# EasyEDA Pro project ProPrj_Embedded Tools_2024-11-02.epro, board X-Link&OSBDM
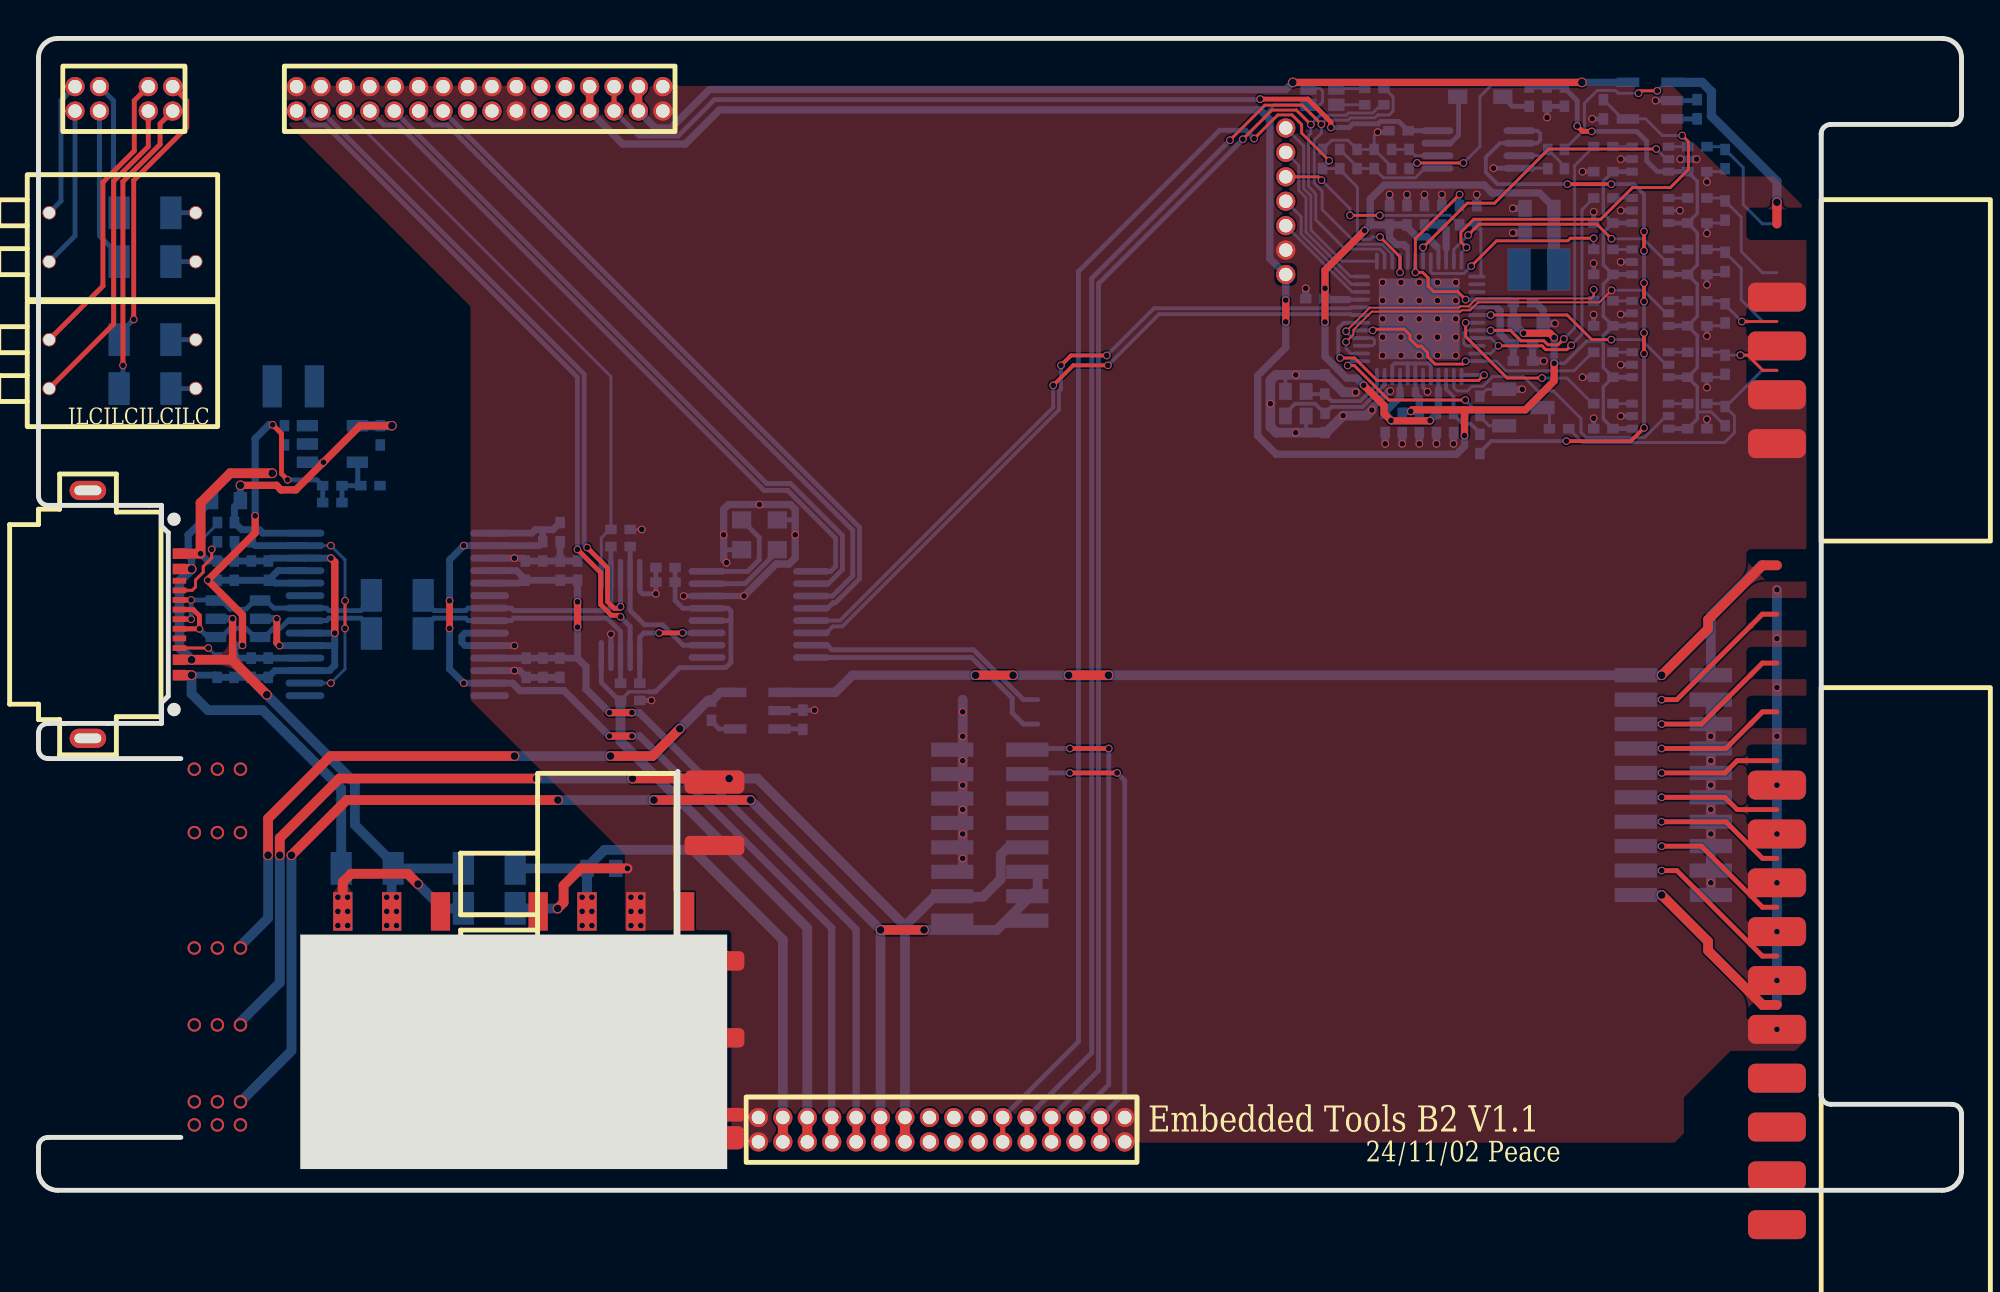
[diagram p9: board, top side]
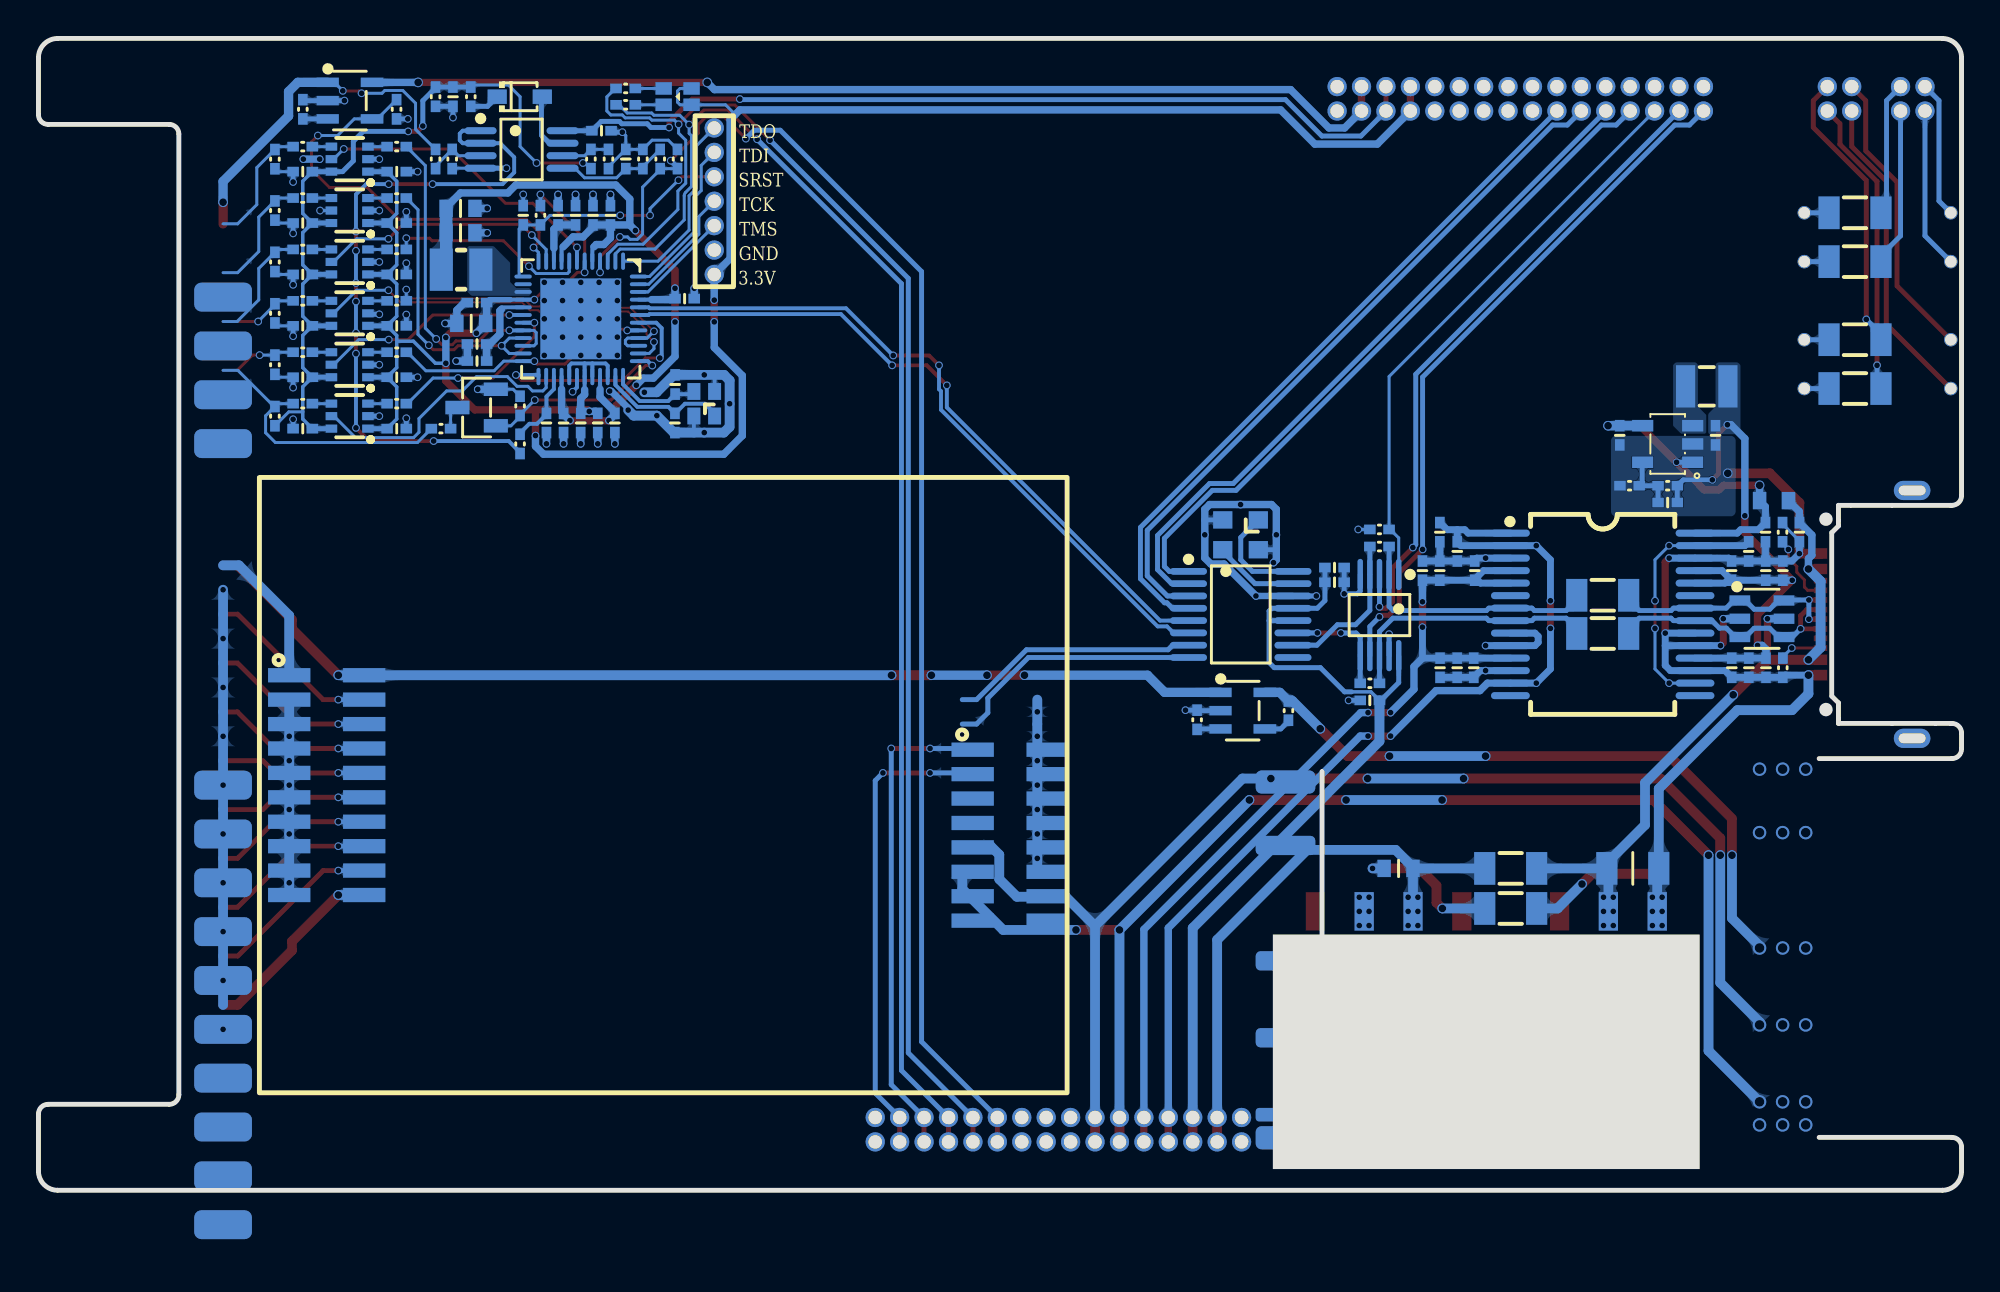
[diagram p10: board, bottom side, seen from below]

Outline 100 x 59.9 mm; copper layers: Top Layer, Bottom Layer. Coordinates in mm from the lower left corner of the outline.
Outline path: 7.4,22.45 0.5,22.45 arc(0.15,22.6) 0,22.95 0,23.78 arc(0.15,24.13) 0.5,24.28 0.57,24.28 ; 7.4,2.75 0.5,2.75 arc(0.15,2.6) 0,2.25 0,1 arc(0.29,0.29) 1,0 99,0 arc(99.71,0.29) 100,1 100,3.97 arc(99.85,4.32) 99.5,4.47 93.2,4.47 arc(92.85,4.62) 92.7,4.97 92.7,54.93 arc(92.85,55.28) 93.2,55.43 99.5,55.43 arc(99.85,55.58) 100,55.93 100,58.9 arc(99.71,59.61) 99,59.9 1,59.9 arc(0.29,59.61) 0,58.9 0,36.12 arc(0.15,35.77) 0.5,35.62 0.57,35.62
Stack: Top Layer 0.035mm / Dielectric1 1.51mm FR4 er 4.5 / Bottom Layer 0.035mm

## Design rules (mm)
template: 双面板
spacing copperThickness1oz (default): track to track 0.102, other pairs 0.102 to 0.201
spacing copperThickness2oz: track to track 0.203, other pairs 0.152 to 0.3
track width copperThickness1oz (default): min 0.102, default 0.254, max 2.54
track width copperThickness2oz: min 0.203, default 0.254, max 2.54
differential pair differentialPair (default): width min 0.127, default 0.254, max 2.54; gap min 0.152, default 0.152
via viaSize (default): diameter min 0.399, default 0.399, max 10; hole min 0.3, default 0.3, max 6.299

## Placement (name value [footprint] x y rotation side)
B1  600R@100MHz  [L0603]  9.75 35.86 0 bottom
C1  100nF  [C0402]  74.79 50.7 270 bottom
C2  100nF  [C0402]  69.46 53.63 270 bottom
C3  2.2uF  [C0402]  78.45 56.87 90 bottom
C4  10pF  [C0402]  66.9 39.9 90 bottom
C5  10pF  [C0402]  66.89 41.9 270 bottom
C6  100nF  [C0402]  70.72 55.1 180 bottom
C7  100nF  [C0402]  73.58 39.9 90 bottom
C8  22uF  [C0603]  77.5 45.08 180 bottom
C9  4.7uF  [C0402]  77.2 43.12 180 bottom
C10  4.7uF  [C0402]  72.07 50.7 270 bottom
C11  100nF  [C0402]  70.03 39.9 90 bottom
C12  4.7uF  [C0402]  70.92 39.9 90 bottom
C13  100nF  [C0402]  77.2 46.16 180 bottom
C14  100nF  [C0402]  77.2 44.01 180 bottom
C15  100nF  [C0402]  72.98 50.7 270 bottom
C16  22uF  [C0603]  78.05 51.06 0 bottom
C17  100nF  [C0402]  70.26 50.7 270 bottom
C18  100nF  [C0402]  71.81 39.9 90 bottom
C19  22uF  [C0603]  78.05 49.79 0 bottom
C20  100nF  [C0402]  72.69 39.9 90 bottom
C21  100nF  [C0402]  71.16 50.7 270 bottom
C22  100nF  [C0402]  66.4 46.37 0 bottom
C23  100nF  [C0402]  81.37 44.95 0 bottom
C24  100nF  [C0402]  81.37 42.28 0 bottom
C25  100nF  [C0402]  81.37 52.97 0 bottom
C26  100nF  [C0402]  81.37 50.3 0 bottom
C27  100nF  [C0402]  81.37 47.63 0 bottom
C28  100nF  [C0402]  81.37 39.61 0 bottom
C29  100nF  [C0402]  86.26 44.95 180 bottom
C30  100nF  [C0402]  86.26 42.28 180 bottom
C31  100nF  [C0402]  86.26 52.97 180 bottom
C32  100nF  [C0402]  86.26 50.3 180 bottom
C33  100nF  [C0402]  86.26 47.63 180 bottom
C34  100nF  [C0402]  86.26 39.61 180 bottom
C35  10uF  [C0402]  32.6 32.38 0 bottom
C36  100nF  [C0402]  32.6 31.62 0 bottom
C37  100nF  [C0402]  8.43 34.22 90 bottom
C38  4.7uF  [C0402]  17.77 39.26 90 bottom
C39  10pF  [C0402]  15.28 35.76 180 bottom
C40  10uF  [C0402]  12.79 39.26 90 bottom
C41  4.7uF  [C0402]  10.19 34.22 90 bottom
C42  100nF  [C0402]  11.07 33.22 90 bottom
C43  2.2uF  [C0402]  9.29 32.22 90 bottom
C44  2.2uF  [C0402]  10.17 27.17 270 bottom
C45  100uF  [C1206]  17.09 16.74 0 bottom
C46  100nF  [C0402]  10.18 32.22 90 bottom
C47  100nF  [C0402]  11.06 27.17 270 bottom
C48  10nF  [C0402]  11.96 32.22 90 bottom
C49  10nF  [C0402]  11.95 27.17 270 bottom
C50  2.2uF  [C0402]  28.03 32.22 90 bottom
C51  2.2uF  [C0402]  27.12 27.17 270 bottom
C52  22uF  [C0603]  29.27 16.74 180 bottom
C53  100nF  [C0402]  27.13 32.22 90 bottom
C54  100nF  [C0402]  26.23 27.17 270 bottom
C55  10nF  [C0402]  25.31 32.22 90 bottom
C56  10nF  [C0402]  25.36 27.17 270 bottom
C57  100nF  [C0402]  30.77 25.48 180 bottom
C58  4.7uF  [C0402]  27.13 34.22 90 bottom
C59  100nF  [C0402]  26.22 33.22 90 bottom
D1  -  [LED1615]  66.76 56.88 180 bottom
D2  1N5819WS  [SOD-323_L1.8-W1.3-LS2.5-RD]  74.97 56.87 180 bottom
D3  USBLC6-2SC6  [SOT-23-6_L2.9-W1.6-P0.95-LS2.8-BL]  10.38 29.72 270 bottom
L1  4.7uH  [IND-SMD_L2.5-W2.0]  78.02 47.88 180 bottom
L2  2.2uH  [IND-SMD_L2.5-W2.0_MHCHL2520]  13.25 41.81 180 bottom
NOREF  -  [Pad_e3233]  28.52 14.5 0 top
NOREF#2  -  [Pad_e3240]  31.06 14.5 0 top
NOREF#3  -  [Pad_e3157]  18.36 14.5 0 top
NOREF#4  -  [Pad_e3150]  15.82 14.5 0 top
P1  974dc19cbdb643b88376196303d419e6  [HDR-SMD_16P-P1.27-V-M-R2-C8-LS5.5]  50.01 21.07 270 bottom
P2  bb576532c6a742fab86a2945802cc5ea  [HDR-SMD_20P-P1.27-V-M-R2-C10-LS5.5]  85.01 21.07 270 bottom
P3  123946e5df864220b5dd1d9a534aecc2  [HDR-TH_7P-P1.27-V-M-1]  64.86 51.43 90 bottom
P4  120433638dee48a48d4bdcbcf660e3d8  [HDR-TH_10P-P1.27-V-M-R2-C5-S1.27_1]  4.44 56.76 0 top
P5  -  [IDC-SMD_8P-P2.54]  90.4 46.45 0 top
P6  -  [IDC-SMD_20P-P2.54]  90.4 21.07 0 top
Q1  SI2302A  [SOT-23-3_L2.9-W1.3-P1.90-LS2.4-BR]  77.22 40.71 180 bottom
R1  100K  [R0402]  35 24.94 90 bottom
R2  12K  [R0402]  39.75 24.47 270 bottom
R3  10K  [R0402]  73.9 50.7 90 bottom
R4  1K  [R0402]  66.77 53.63 90 bottom
R5  10K  [R0402]  67.67 53.63 90 bottom
R6  100K  [R0402]  68.57 53.63 90 bottom
R7  1K  [R0402]  69.47 57.3 180 bottom
R8  1K  [R0402]  69.47 56.45 180 bottom
R9  10K  [R0402]  71.27 53.63 90 bottom
R10  10K  [R0402]  70.36 53.63 270 bottom
R11  100R  [R0402]  77.52 56.87 270 bottom
R12  100K  [R0402]  79.35 56.87 270 bottom
R13  100K  [R0402]  79.35 53.63 270 bottom
R14  100K  [R0402]  78.49 53.63 270 bottom
R15  100K  [R0402]  81.38 56.22 90 bottom
R16  12K  [R0402]  86.25 56.22 270 bottom
R17  220R  [R0402]  81.37 46.25 0 bottom
R18  220R  [R0402]  81.37 43.58 0 bottom
R19  220R  [R0402]  81.37 54.27 0 bottom
R20  220R  [R0402]  81.37 51.6 0 bottom
R21  220R  [R0402]  81.37 48.93 0 bottom
R22  220R  [R0402]  81.37 40.91 0 bottom
R23  100K  [R0402]  74.96 40.79 90 bottom
R24  100K  [R0402]  87.7 40.26 90 bottom
R25  100R  [R0402]  79.07 39.61 0 bottom
R26  100R  [R0402]  86.26 46.25 0 bottom
R27  100R  [R0402]  86.26 43.58 0 bottom
R28  100R  [R0402]  86.26 54.27 0 bottom
R29  100R  [R0402]  86.26 51.6 0 bottom
R30  100R  [R0402]  86.26 48.93 0 bottom
R31  100R  [R0402]  86.26 40.91 0 bottom
R32  200K  [R0402]  87.7 45.6 90 bottom
R33  200K  [R0402]  87.7 42.93 90 bottom
R34  200K  [R0402]  87.7 53.62 90 bottom
R35  200K  [R0402]  87.7 50.95 90 bottom
R36  200K  [R0402]  87.7 48.28 90 bottom
R37  5.1K  [R0402]  9.29 27.17 90 bottom
R38  5.1K  [R0402]  9.31 34.22 270 bottom
R39  200K  [R0402]  15.28 36.64 180 bottom
R40  100K  [R0402]  17.26 36.64 180 bottom
R41  100K  [R0402]  30.27 34.37 0 bottom
R42  0R/NC  [R1206]  23.44 16.74 0 bottom
R43  0R/NC  [R1206]  23.44 14.66 0 bottom
R44  0R/NC  [R1206]  18.66 30.94 0 bottom
R45  0R/NC  [R1206]  18.66 28.96 0 bottom
R46  0R/NC  [R0402]  30.27 33.48 0 bottom
R47  0R/NC  [R0402]  30.77 26.37 0 bottom
R48  120R  [R1206]  5.54 50.83 0 bottom
R49  120R  [R1206]  5.54 48.29 0 bottom
R50  120R  [R1206]  5.54 44.23 0 bottom
R51  120R  [R1206]  5.54 41.69 0 bottom
R52  1K  [R0402]  74.96 38.81 90 bottom
SW1  SS23H37L4  [SW-TH_SS23H37LX_SMD]  9.3 12.6 0 top
U1  SY6280AAC  [SOT-23-5_L3.0-W1.7-P0.95-LS2.8-BL]  37.38 24.94 270 bottom
U2  0fddbf5b7085485a9a03ce0ba17bfba0  [QFN-48_L6.0-W6.0-P0.4-BL-EP4.2]  71.8 45.32 0 bottom
U3  SY6280AAC  [SOT-23-5_L3.0-W1.7-P0.95-LS2.8-BL]  83.81 56.67 270 bottom
U4  74LVC1T45DW-7  [SC-70-6_L2.2-W1.3-P0.65-LS2.1-BR]  83.82 45.6 180 bottom
U5  74LVC1T45DW-7  [SC-70-6_L2.2-W1.3-P0.65-LS2.1-BR]  83.82 42.93 180 bottom
U6  74LVC1T45DW-7  [SC-70-6_L2.2-W1.3-P0.65-LS2.1-BR]  83.82 53.62 180 bottom
U7  74LVC1T45DW-7  [SC-70-6_L2.2-W1.3-P0.65-LS2.1-BR]  83.82 50.95 180 bottom
U8  74LVC1T45DW-7  [SC-70-6_L2.2-W1.3-P0.65-LS2.1-BR]  83.82 48.28 180 bottom
U9  74LVC1T45DW-7  [SC-70-6_L2.2-W1.3-P0.65-LS2.1-BR]  83.82 40.26 180 bottom
U10  CH334R  [QSOP-16_L4.9-W3.9-P0.64-LS6.0-BL]  37.48 29.95 270 bottom
U11  TLV62568DBVR  [SOT-23-5_L3.0-W1.7-P0.95-LS2.8-BR]  15.28 38.81 180 bottom
U12  ISOUSB211DPR  [SSOP-28_L10.3-W7.5-P0.65-LS10.3-BL]  18.66 29.95 270 bottom
U13  VRB0505S-5WR3  [PWRM-TH_7P-L22.0-W9.5-P2.54_VRB0505S-5WR3_ST]  24.71 14.5 0 top
U14  SGM7222YMS10/TR  [MSOP-10_L3.0-W3.0-P0.50-LS5.0-BL]  30.27 29.91 0 bottom
U15  d41f87750cb249d39c6e00b53de6cf37  [HDR-TH_32P-P1.27-V-M-R2-C16-S1.27]  46.96 3.15 0 top
U16  d41f87750cb249d39c6e00b53de6cf37  [HDR-TH_32P-P1.27-V-M-R2-C16-S1.27]  22.95 56.76 0 top
U17  SMQP-02R-TP  [SW-TH_4P-P2.54_SMQP-02R-TP]  4.37 49.56 270 top
U18  SMQP-02R-TP  [SW-TH_4P-P2.54_SMQP-02R-TP]  4.37 42.96 270 top
U19  LMV358AIDGKR  [VSSOP-8_L3.0-W3.0-P0.65-LS5.0-BL]  74.88 54.13 270 bottom
USB1  USB31-TYPEC-16X7C-1FS  [USB-SMD_USB31-TYPEC-16X7C-1FS]  4.95 29.95 270 top
X1  24MHz  [CRYSTAL-SMD_4P-L2.0-W1.6-BL-A]  65.38 40.9 90 bottom
X2  12MHz  [CRYSTAL-SMD_4P-L2.5-W2.0-BL-A]  37.49 34.09 0 bottom

## Footprints (pads in the part's own frame, mm; a bottom-side part is the same pattern mirrored in y, then rotated)
C0402
  rect 0.6x0.5 smd: 1(-0.5,0) 2(0.5,0)
C0603
  rect 0.7x0.9 smd: 1(-0.75,0) 2(0.75,0)
C1206
  rect 1.1x1.7 smd: 1(-1.35,0) 2(1.35,0)
CRYSTAL-SMD_4P-L2.0-W1.6-BL-A
  rect 0.875x0.673 smd: 1(-0.638,-0.539) 2(0.638,-0.539) 3(0.638,0.539) 4(-0.638,0.539)
CRYSTAL-SMD_4P-L2.5-W2.0-BL-A
  rect 1x0.9 smd: 1(-0.925,-0.775) 2(0.925,-0.775) 3(0.925,0.775) 4(-0.925,0.775)
HDR-SMD_16P-P1.27-V-M-R2-C8-LS5.5
  rect 0.74x2.2 smd: 1(-1.841,-1.409) 2(-1.841,2.49) 3(-0.572,-1.409) 4(-0.572,2.49) 5(0.699,-1.409) 6(0.699,2.49) 7(1.968,-1.409) 8(1.968,2.49) 9(3.239,-1.409) 10(3.239,2.49) 11(4.508,-1.409) 12(4.508,2.49) 13(5.779,-1.409) 14(5.779,2.49) 15(7.048,-1.409) 16(7.048,2.49)
HDR-SMD_20P-P1.27-V-M-R2-C10-LS5.5
  rect 0.74x2.2 smd: 1(-5.715,-1.95) 2(-5.715,1.95) 3(-4.445,-1.95) 4(-4.445,1.95) 5(-3.175,-1.95) 6(-3.175,1.95) 7(-1.905,-1.95) 8(-1.905,1.95) 9(-0.635,-1.95) 10(-0.635,1.95) 11(0.635,-1.95) 12(0.635,1.95) 13(1.905,-1.95) 14(1.905,1.95) 15(3.175,-1.95) 16(3.175,1.95) 17(4.445,-1.95) 18(4.445,1.95) 19(5.715,-1.95) 20(5.715,1.95)
HDR-TH_7P-P1.27-V-M-1
  rrect 1x1 hole 0.7: 1(-3.81,0)
  round 1 hole 0.7: 2(-2.54,0) 3(-1.27,0) 4(0,0) 5(1.27,0) 6(2.54,0) 7(3.81,0)
HDR-TH_10P-P1.27-V-M-R2-C5-S1.27_1
  rrect 1x1 hole 0.7: 1(-2.54,-0.635)
  round 1 hole 0.7: 2(-2.54,0.635) 3(-1.27,-0.635) 4(-1.27,0.635) 7(1.27,-0.635) 8(1.27,0.635) 9(2.54,-0.635) 10(2.54,0.635)
HDR-TH_32P-P1.27-V-M-R2-C16-S1.27
  rrect 1x1 hole 0.7: 1(-9.525,-0.635)
  round 1 hole 0.7: 2(-9.525,0.635) 3(-8.255,-0.635) 4(-8.255,0.635) 5(-6.985,-0.635) 6(-6.985,0.635) 7(-5.715,-0.635) 8(-5.715,0.635) 9(-4.445,-0.635) 10(-4.445,0.635) 11(-3.175,-0.635) 12(-3.175,0.635) 13(-1.905,-0.635) 14(-1.905,0.635) 15(-0.635,-0.635) 16(-0.635,0.635) 17(0.635,-0.635) 18(0.635,0.635) 19(1.905,-0.635) 20(1.905,0.635) 21(3.175,-0.635) 22(3.175,0.635) 23(4.445,-0.635) 24(4.445,0.635) 25(5.715,-0.635) 26(5.715,0.635) 27(6.985,-0.635) 28(6.985,0.635) 29(8.255,-0.635) 30(8.255,0.635) 31(9.525,-0.635) 32(9.525,0.635)
IDC-SMD_8P-P2.54
  rrect 3x1.5 smd: 1(0,0) 3(0,-2.54) 5(0,-5.08) 7(0,-7.62)
  rrect 3x1.5 smd far side: 2(0,0) 4(0,-2.54) 6(0,-5.08) 8(0,-7.62)
IDC-SMD_20P-P2.54
  rrect 3x1.5 smd: 1(0,0) 3(0,-2.54) 5(0,-5.08) 7(0,-7.62) 9(0,-10.16) 11(0,-12.7) 13(0,-15.24) 15(0,-17.78) 17(0,-20.32) 19(0,-22.86)
  rrect 3x1.5 smd far side: 2(0,0) 4(0,-2.54) 6(0,-5.08) 8(0,-7.62) 10(0,-10.16) 12(0,-12.7) 14(0,-15.24) 16(0,-17.78) 18(0,-20.32) 20(0,-22.86)
IND-SMD_L2.5-W2.0
  rect 1.2x2.2 smd: 1(1.028,0) 2(-1.028,0)
IND-SMD_L2.5-W2.0_MHCHL2520
  rect 1x2.2 smd: 1(-1.1,0) 2(1.1,0)
L0603
  rect 0.7x0.9 smd: 1(-0.75,0) 2(0.75,0)
LED1615
  rect 0.85x0.65 smd: 1(-0.725,0.425) 2(-0.725,-0.425) 3(0.725,-0.425) 4(0.725,0.425)
MSOP-10_L3.0-W3.0-P0.50-LS5.0-BL
  oval 0.28x1.621 smd: 1(-1.001,-2.111) 2(-0.5,-2.111) 3(0,-2.111) 4(0.5,-2.111) 5(1.001,-2.111) 6(1.001,2.111) 7(0.5,2.111) 8(0,2.111) 9(-0.5,2.111) 10(-1.001,2.111)
Pad_e3150
  rect 1x2 smd far side: 1(0,0)
Pad_e3157
  rect 1x2 smd far side: 1(0,0)
Pad_e3233
  rect 1x2 smd far side: 1(0,0)
Pad_e3240
  rect 1x2 smd far side: 1(0,0)
PWRM-TH_7P-L22.0-W9.5-P2.54_VRB0505S-5WR3_ST
  rect 1x2 smd: 1(-8.89,0) 2(-6.35,0) 3(-3.81,0) 5(1.27,0) 6(3.81,0) 7(6.35,0) 8(8.89,0)
QFN-48_L6.0-W6.0-P0.4-BL-EP4.2
  oval 0.2x0.9 smd: 1(-2.2,-3) 2(-1.8,-3) 3(-1.4,-3) 4(-1,-3) 5(-0.6,-3) 6(-0.2,-3) 7(0.2,-3) 8(0.6,-3) 9(1,-3) 10(1.4,-3) 11(1.8,-3) 12(2.2,-3) 25(2.2,3) 26(1.8,3) 27(1.4,3) 28(1,3) 29(0.6,3) 30(0.2,3) 31(-0.2,3) 32(-0.6,3) 33(-1,3) 34(-1.4,3) 35(-1.8,3) 36(-2.2,3)
  oval 0.9x0.2 smd: 13(3,-2.2) 14(3,-1.8) 15(3,-1.4) 16(3,-1) 17(3,-0.6) 18(3,-0.2) 19(3,0.2) 20(3,0.6) 21(3,1) 22(3,1.4) 23(3,1.8) 24(3,2.2) 37(-3,2.2) 38(-3,1.8) 39(-3,1.4) 40(-3,1) 41(-3,0.6) 42(-3,0.2) 43(-3,-0.2) 44(-3,-0.6) 45(-3,-1) 46(-3,-1.4) 47(-3,-1.8) 48(-3,-2.2)
  rect 4.2x4.2 smd: 49(0,0)
QSOP-16_L4.9-W3.9-P0.64-LS6.0-BL
  oval 0.35x1.921 smd: 1(-2.24,-2.716) 2(-1.6,-2.716) 3(-0.96,-2.716) 4(-0.32,-2.716) 5(0.32,-2.716) 6(0.96,-2.716) 7(1.6,-2.716) 8(2.24,-2.716) 9(2.24,2.716) 10(1.6,2.716) 11(0.96,2.716) 12(0.32,2.716) 13(-0.32,2.716) 14(-0.96,2.716) 15(-1.6,2.716) 16(-2.24,2.716)
R0402
  rect 0.6x0.5 smd: 1(-0.5,0) 2(0.5,0)
R1206
  rect 1.1x1.7 smd: 1(-1.35,0) 2(1.35,0)
SC-70-6_L2.2-W1.3-P0.65-LS2.1-BR
  rect 0.6x0.42 smd: 1(0.95,-0.65) 2(0.95,0) 3(0.95,0.65) 4(-0.95,0.65) 5(-0.95,0) 6(-0.95,-0.65)
SOD-323_L1.8-W1.3-LS2.5-RD
  rect 1x0.75 smd: 1(-1.173,0) 2(1.173,0)
SOT-23-3_L2.9-W1.3-P1.90-LS2.4-BR
  rect 1.25x0.7 smd: 1(1,-0.95) 2(1,0.95) 3(-1,0)
SOT-23-5_L3.0-W1.7-P0.95-LS2.8-BL
  rect 0.49x1.157 smd: 1(-0.95,-1.153) 2(0,-1.153) 3(0.95,-1.153)
  rect 0.49x1.175 smd: 4(0.95,1.153) 5(-0.95,1.153)
SOT-23-5_L3.0-W1.7-P0.95-LS2.8-BR
  rect 1.1x0.6 smd: 1(1.3,-0.95) 2(1.3,0) 3(1.3,0.95) 4(-1.3,0.95) 5(-1.3,-0.95)
SOT-23-6_L2.9-W1.6-P0.95-LS2.8-BL
  rect 0.532x1.072 smd: 1(-0.95,-1.149) 2(0,-1.149) 3(0.95,-1.149) 4(0.95,1.149) 5(0,1.149) 6(-0.95,1.149)
SSOP-28_L10.3-W7.5-P0.65-LS10.3-BL
  oval 0.364x2.015 smd: 1(-4.225,-4.8) 2(-3.575,-4.8) 3(-2.925,-4.8) 4(-2.275,-4.8) 5(-1.625,-4.8) 6(-0.975,-4.8) 7(-0.325,-4.8) 8(0.325,-4.8) 9(0.975,-4.8) 10(1.625,-4.8) 11(2.275,-4.8) 12(2.925,-4.8) 13(3.575,-4.8) 14(4.225,-4.8) 15(4.225,4.8) 16(3.575,4.8) 17(2.925,4.8) 18(2.275,4.8) 19(1.625,4.8) 20(0.975,4.8) 21(0.325,4.8) 22(-0.325,4.8) 23(-0.975,4.8) 24(-1.625,4.8) 25(-2.275,4.8) 26(-2.925,4.8) 27(-3.575,4.8) 28(-4.225,4.8)
SW-TH_4P-P2.54_SMQP-02R-TP
  round 0.7 hole 0.6: 1(-1.27,-3.81) 2(1.27,-3.81) 3(1.27,3.81) 4(-1.27,3.81)
SW-TH_SS23H37LX_SMD
  rrect 3.1x1 smd far side: 1(25.85,5.331) 2(25.85,-0.669) 3(25.85,-4.669)
  rrect 3.1x0.7 smd far side: 4(25.85,-8.669)
  rrect 3.1x0.7 smd: 5(25.85,-8.669)
  rrect 3.1x1 smd: 6(25.85,-4.669) 7(25.85,-0.669) 8(25.85,5.331)
  rrect 3.1x1.2 smd: 9(25.85,8.631) 10(25.85,-9.869)
  rrect 3.1x1.2 smd far side: 11(25.85,-9.869) 12(25.85,8.631)
USB-SMD_USB31-TYPEC-16X7C-1FS
  rect 0.55x0.7 smd: 1(-3.16,2.38) 2(-2.36,2.38) 11(2.36,2.38) 12(3.16,2.38)
  rect 0.3x0.7 smd: 3(-1.75,2.38) 4(-1.25,2.38) 5(-0.75,2.38) 6(-0.25,2.38) 7(0.25,2.38) 8(0.75,2.38) 9(1.25,2.38) 10(1.75,2.38)
  oval 1x1.9 hole 0.5x1.4: 13(-6.445,-2.38) 16(6.445,-2.38)
VSSOP-8_L3.0-W3.0-P0.65-LS5.0-BL
  oval 0.364x1.662 smd: 1(-0.975,-2.131) 2(-0.325,-2.131) 3(0.325,-2.131) 4(0.975,-2.131) 5(0.975,2.131) 6(0.325,2.131) 7(-0.325,2.131) 8(-0.975,2.131)

## Nets
As in the schematic, except:
5V: C52.2 NOREF.1 R42.2 U13.6 U15.3 U15.4
GND: C1.1 C2.1 C3.1 C4.1 C5.1 C6.2 C7.1 C8.1 C9.1 C10.1 C11.1 C12.1 C13.1 C14.1 C15.1 C16.1 C17.1 C18.1 C19.1 C20.1 C21.1 C22.1 C23.1 C24.1 C25.1 C26.1 C27.1 C28.1 C29.1 C30.1 C31.1 C32.1 C33.1 C34.1 C35.1 C36.1 C50.2 C51.2 C52.1 C53.2 C54.2 C55.2 C56.2 C57.1 C58.1 C59.1 NOREF#2.1 P1.2 P1.4 P1.6 P1.8 P1.10 P1.12 P1.14 P1.16 P2.3 P2.5 P2.7 P2.9 P2.11 P2.13 P2.15 P2.17 P2.19 P3.2 P5.3 P6.4 P6.6 P6.8 P6.10 P6.12 P6.14 P6.16 P6.18 P6.20 Q1.2 R2.1 R4.2 R6.2 R10.2 R12.2 R14.2 R15.1 R16.1 R23.2 R32.1 R33.1 R34.1 R35.1 R36.1 R41.2 R43.2 U1.2 U2.30 U2.49 U3.2 U4.2 U5.2 U6.2 U7.2 U7.5 U8.2 U9.2 U10.14 U12.3 U12.9 U12.10 U12.12 U13.7 U14.5 U14.9 U15.1 U15.2 U15.31 U15.32 U16.2 U16.4 U16.6 U16.8 U16.10 U16.12 U16.14 U16.16 U16.18 U16.19 U16.20 U16.31 U16.32 U19.4 X1.2 X1.4 X2.2 X2.4
O_SRST: P5.8 R24.2 R25.2 R31.2
O_TCK: P5.7 R27.2 R33.2
O_TDI: P5.2 R28.2 R34.2
O_TDO: P5.4 R29.2 R35.2
O_TMS: P5.5 R26.2 R32.2
O_TRST: P5.6 R30.2 R36.2
O_VREF: P5.1 R13.1 U3.1
U_GND: C37.1 C38.1 C40.1 C41.1 C42.1 C43.2 C44.2 C45.1 C46.2 C47.2 C48.2 C49.2 D3.2 NOREF#4.1 R37.1 R38.1 R40.1 R43.1 U11.2 U12.17 U12.19 U12.20 U12.26 U13.1 USB1.1 USB1.12
U_VBUS: B1.1 C37.2 C45.2 D3.5 NOREF#3.1 R42.1 U13.2 USB1.2 USB1.11

Pads without a net: P1 9 11; SW1 1 8 9 10 11 12; U2 14; U10 9; U12 6 14 15 23; U13 3 5 8; U15 15 16 17 18 19 20; U16 15 17 21 22 23 24; USB1 3 9 13 16

## Via types
v1: diameter 0.7, hole 0.5, Top Layer to Bottom Layer, 18 vias
v2: diameter 0.5, hole 0.4, Top Layer to Bottom Layer, 32 vias
v3: diameter 0.4, hole 0.3, Top Layer to Bottom Layer, 265 vias

## Routing (per net, layer and track width the routed paths; a pad name or vN(x,y) marks a point on that pad's centre or on a via; arc(x,y) is an arc through that point)
3.3V: length 45.1
  Top Layer w0.508: U15.5 U15.6
  Bottom Layer w0.178: 31.72,25.92 30.71,25.92 C57.2
  Bottom Layer w0.254: 31.72,25.92 32.08,25.92 33.34,27.18 35.74,27.18 36.01,27.45 36.01,29.63 ; 36.01,29.63 U10.12 ; 36.01,29.63 36.01,30.12 35.87,30.27 U10.13 33.5,30.27 33.1,30.67 C36.2 C35.2 ; 29.27,27.8 29.27,26.4 30.19,25.48 C57.2
  Bottom Layer w0.508: C57.2 30.27,23.35 39.98,13.64 U15.6
5V: length 29
  Top Layer w0.508: U15.3 U15.4
  Bottom Layer w0.508: U15.4 38.71,13.02 34.03,17.7 29.43,17.7 28.52,16.8 C52.2 ; C52.2 U13.6 ; C52.2 R42.2
  vias: v3(28.27,15.24) v3(28.27,14.5) v3(28.27,13.77) v3(28.78,15.24) v3(28.78,14.5) v3(28.78,13.77)
GND: length 148.1
  Top Layer w0.508: v3(30.63,16.74) 28.19,16.74 27.31,15.85 27.31,14.96 v2(27,14.66)
  Bottom Layer w0.152: Q1.2 75.32,41.66 R23.2 ; R36.1 87.55,47.63 C33.1 ; R34.1 87.55,52.97 C31.1 ; U19.4 78.46,53.15 R14.2 ; C2.1 R6.2 68.09,54.61 67.25,54.61 R4.2 ; C2.1 70.36,53.23 R10.2 ; C2.1 69.46,54.85 v3(69.64,55.03) ; R32.1 87.55,44.95 C29.1 ; C30.1 87.55,42.28 R33.1 ; C32.1 87.55,50.3 R35.1 ; U7.5 v3(85.36,50.95) ; R41.2 v3(31.37,34.37)
  Bottom Layer w0.201: X1.4 65.92,39.4 ; v3(72.23,41.53) 72,41.75 U2.30 ; v3(74.79,51.79) C1.1 ; X1.2 64.84,42.4
  Bottom Layer w0.254: v3(80.29,52.97) C25.1 ; C57.1 v3(31.87,25.48) ; C6.2 70.15,55.03 v3(69.64,55.03) ; R12.2 C3.1 v3(78.45,55.79) ; U14.5 31.27,31.17 31.42,31.02 v3(32.1,31.02) C36.1 C35.1 ; v3(80.87,45.54) C23.1 ; v3(80.87,50.88) C26.1 ; R16.1 86.2,56.67 U3.2 v3(84.09,56.67) ; C29.1 v3(86.76,44.42) ; U10.14 v3(33.55,30.91) ; v3(40.36,24.97) R2.1 39.73,24.94 U1.2 ; v3(80.79,55.72) R15.1 ; v3(82.28,45.55) 82.82,45.55 U4.2 ; C30.1 v3(86.76,41.74) ; C33.1 v3(86.76,47.09) ; C34.1 v3(86.76,40.1) ; X2.4 35.63,33.31 ; U5.2 v3(82.28,42.93) ; v3(80.29,42.28) C24.1 ; C32.1 v3(86.76,49.76) ; C31.1 v3(86.76,52.44) ; v3(75.66,53.15) U19.4 ; X2.2 39.35,34.86 ; U7.2 v3(82.28,50.95) ; U6.2 v3(82.28,53.62) ; U8.2 v3(82.28,48.28) ; v3(80.87,48.21) C27.1 ; C28.1 v3(80.87,40.15) ; U9.2 v3(82.28,40.26) ; 29.77,27.8 v3(29.77,28.92)
  Bottom Layer w0.33: v3(36.69,30.91) U10.14
  Bottom Layer w0.355: 28.03,32.72 27.14,32.72 ; 27.14,32.72 27.12,32.74 27.12,33.72 ; 27.14,32.72 C59.1 25.36,32.72 25.21,32.87 v3(24.75,32.87) U12.3 ; 27.15,26.67 C54.2 25.37,26.67 25.02,27.02 v3(24.75,27.02) U12.12 ; U12.9 22.18,28.97 22.01,28.81 22.01,28.49 22.18,28.32 U12.10 v3(24.75,28.32) ; v3(69.34,40.57) 69.34,40.68 70.22,41.56 v3(70.3,41.56)
  Bottom Layer w0.381: v3(73.58,38.82) C7.1 ; v3(78.85,45.08) C8.1 78.25,45.77 77.85,46.16 C13.1 ; v3(35.78,32.64) 35.63,32.79 v3(35.63,34.09) 35.63,35.41 35.88,35.66 v3(37.49,35.66) 39.1,35.66 39.35,35.41 v3(39.35,34.09) 39.35,32.88 39.04,32.57 38.35,32.57 v3(36.69,30.91) ; v3(70.03,38.82) C11.1 ; v3(85.38,53.62) v3(86.23,53.62) ; v3(71.16,51.79) C21.1 ; v3(76.67,49.79) C19.1 ; v3(77.16,41.66) Q1.2 ; v3(72.98,51.79) C15.1 ; v3(70.92,38.82) C12.1 ; v3(72.07,51.79) C10.1 ; v3(76.67,51.06) C16.1 ; v3(65.9,46.91) C22.1 ; v3(71.81,38.82) C18.1 ; v3(72.69,38.82) C20.1 ; v3(78.28,43.12) C9.1 C14.1 ; v3(70.26,51.79) C17.1
  Bottom Layer w0.508: P2.3 P2.5 v3(86.96,23.61) v3(86.96,22.34) P2.9 v3(86.96,21.07) P2.11 v3(86.96,19.8) P2.13 v3(86.96,18.53) P2.17 v3(86.96,15.99) P2.19 ; 64.07,39.69 64.36,39.4 v3(65.38,39.4) C4.1 66.96,39.4 v3(67.84,40.29) 69.05,40.29 v3(69.34,40.57) ; C52.1 v3(30.63,16.74) ; 48.06,16.62 v3(48.06,17.26) v3(48.06,18.53) v3(48.06,19.8) v3(48.06,21.07) v3(48.06,22.34) v3(48.06,23.61) v3(48.06,24.88) 48.06,25.51 ; C5.1 64.35,42.4 64.06,42.11 v3(64.06,40.9) 64.06,39.69 ; 66.95,42.4 67.86,41.5 v3(68.49,41.5) ; 90.4,9.64 v3(90.4,10.91) v3(90.4,13.45) v3(90.4,15.99) v3(90.4,18.53) v3(90.4,21.07) v3(90.4,23.61) v3(90.4,26.15) v3(90.4,28.69) v3(90.4,31.23) ; v2(27,14.66) R43.2
  vias: v3(30.81,15.24) v3(30.81,14.5) v3(30.81,13.77) v3(31.32,15.24) v3(31.32,14.5) v3(31.32,13.77) v3(65.38,42.4) v3(69.9,47.22) v3(69.9,46.27) v3(69.9,45.32) v3(69.9,44.37) v3(69.9,43.42) v3(70.85,47.22) v3(70.85,46.27) v3(70.85,45.32) v3(70.85,44.37) v3(70.85,43.42) v3(71.8,47.22) v3(71.8,46.27) v3(71.8,45.32) v3(71.8,44.37) v3(71.8,43.42) v3(72.75,47.22) v3(72.75,46.27) v3(72.75,45.32) v3(72.75,44.37) v3(72.75,43.42) v3(73.7,47.22) v3(73.7,46.27) v3(73.7,45.32) v3(73.7,44.37) v3(73.7,43.42) v3(90.4,8.37)
(no net):
  vias: v1(8.1,21.9) v1(8.1,18.6) v1(8.1,3.4) v1(9.3,21.9) v1(9.3,18.6) v1(9.3,3.4) v1(10.5,21.9) v1(10.5,18.6) v1(10.5,3.4)
CAN1_H: length 7.1
  Bottom Layer w0.254: U17.1 1.17,51.45 1.17,56.67 P4.2
CAN1_L: length 7
  Bottom Layer w0.254: R48.1 3.9,51.12 3.9,56.67 P4.4
CAN2_H: length 8.4
  Bottom Layer w0.254: U17.2 1.9,49.64 P4.1
CAN2_L: length 8.3
  Bottom Layer w0.254: P4.3 3.17,49.64 4.19,48.62 R49.1
D_1.8V: length 47.4
  Top Layer w0.381: U15.9 U15.10 ; v3(30.86,24.84) v3(29.69,24.84) ; v3(28.03,29.29) 28.03,30.6
  Bottom Layer w0.355: 25.36,31.72 24.86,32.22 U12.4 ; 25.36,31.72 25.16,31.72 25.01,31.57 U12.5 ; 25.36,31.72 C53.1 28.03,31.72 ; U12.11 C56.1 C54.1 C51.1 28.03,27.67 v3(28.03,29.29)
  Bottom Layer w0.381: C50.1 v3(28.03,30.6) ; v3(30.86,24.84) 31.24,24.84 42.52,13.56 U15.10 ; v3(29.69,24.84) 28.47,26.06 28.47,27.23 28.03,27.67
D_3.3V: length 51.8
  Top Layer w0.355: v3(21.38,29.22) v3(21.38,30.66)
  Top Layer w0.381: U15.7 U15.8 ; v3(30.86,23.62) v3(29.69,23.62)
  Bottom Layer w0.355: v3(21.38,29.22) 21.38,27.11 v3(22.11,26.37) U12.13 24.65,26.37 ; 26.22,34.35 26.75,34.35 27.12,34.72 ; 26.22,34.35 C59.2 ; 26.22,34.35 25.83,34.35 25.66,34.17 U12.1 ; v3(21.38,30.66) 21.38,32.79 v3(22.11,33.52) U12.2 26.05,33.52 ; 26.25,33.72 26.23,33.71
  Bottom Layer w0.381: v3(30.86,23.62) 31.27,23.62 41.25,13.64 U15.8 ; 24.65,26.37 25.04,25.98 27.33,25.98 v3(29.69,23.62)
D_USB_DM: length 13.5
  Bottom Layer w0.254: R44.2 20.01,30.7 20.56,30.15 22.21,30.15 22.34,30.27 U12.7 24.58,30.27 24.71,30.15 29.55,30.15 29.77,30.36 R46.1
D_USB_DP: length 13.8
  Bottom Layer w0.254: R45.2 20.01,29.2 20.56,29.75 22.21,29.75 22.34,29.62 U12.8 24.58,29.62 24.71,29.75 29.57,29.75 30.27,29.06 R47.1
HUB1_USB_DM: length 36.6
  Bottom Layer w0.254: U10.3 41.29,30.91 42.34,31.95 42.34,34.32 21.27,55.4 20.5,55.4 U16.11
HUB1_USB_DP: length 36.4
  Bottom Layer w0.254: U16.13 42.7,34.47 42.7,31.81 41.44,30.55 41.32,30.55 41.04,30.27 U10.4
HUB_USB_DM: length 8.1
  Bottom Layer w0.254: R46.2 U14.4 30.77,30.16 31.51,29.41 32.46,29.41 33.52,28.35 U10.10
HUB_USB_DP: length 6
  Top Layer w0.254: v3(32.27,28.98) 32.28,28.99 v3(33.5,28.99)
  Bottom Layer w0.254: R47.2 31.27,28.76 31.49,28.98 v3(32.27,28.98) ; v3(33.5,28.99) U10.11
J_3.3V: length 68.1
  Top Layer w0.508: U15.14 U15.13 ; v2(35.91,21.41) v2(30.89,21.41) ; v2(25.89,21.41) 15.65,21.41 12.55,18.31 v2(12.55,17.42)
  Bottom Layer w0.508: v2(30.89,21.41) v2(25.89,21.41) ; v2(12.55,17.42) 12.55,10.79 10.5,8.75 v1(10.5,8.6) ; 51.96,17.89 50.48,17.89 50.04,17.45 50.04,16.18 49.12,15.27 46.58,15.27 45.06,13.74 ; 45.06,13.74 U15.14 ; 45.06,13.74 37.39,21.41 v2(35.91,21.41)
  vias: v1(8.1,8.6) v1(9.3,8.6)
J_5V: length 69.6
  Top Layer w0.508: v2(27.01,20.29) 16.03,20.29 v2(13.16,17.42) ; U15.12 U15.11 ; 43.79,13.54 v2(46.05,13.54) ; v2(32,20.29) v2(37.03,20.29)
  Bottom Layer w0.508: v2(37.03,20.29) v2(43.79,13.54) U15.12 ; v2(46.05,13.54) 49.84,13.54 51.96,15.66 51.96,16.62 ; v1(10.5,4.6) 13.16,7.25 v2(13.16,17.42) ; v2(27.01,20.29) v2(32,20.29)
  vias: v1(8.1,4.6) v1(9.3,4.6)
J_5V_OUT: length 10
  Top Layer w0.508: 90.4,9.64 89.65,9.64 86.82,12.47 86.82,12.95 v2(84.41,15.35)
  Bottom Layer w0.508: P2.20 v2(84.41,15.35)
J_LED_GREEN: length 24
  Top Layer w0.254: U15.30 U15.29 ; v3(53.64,21.7) v3(56.09,21.7)
  Bottom Layer w0.254: v3(56.09,21.7) 56.49,21.3 56.49,5.06 U15.30 ; 51.96,21.7 v3(53.64,21.7)
J_LED_RED: length 24.9
  Top Layer w0.254: U15.27 U15.28 ; v3(53.64,22.97) v3(55.66,22.97)
  Bottom Layer w0.254: v3(55.66,22.97) 55.66,5.49 U15.28 ; 51.96,22.97 v3(53.64,22.97)
J_NC: length 7.6
  Bottom Layer w0.508: P2.1 86.96,29.89 89.57,32.5 90.4,32.5
J_RTCK: length 7.6
  Top Layer w0.254: 90.4,19.8 88.33,19.8 87.69,20.43 v3(84.41,20.43)
  Bottom Layer w0.254: P2.12 v3(84.41,20.43)
J_RXD: length 9.2
  Top Layer w0.254: 90.4,12.18 89.64,12.18 85.2,16.62 v3(84.41,16.62)
  Bottom Layer w0.254: P2.18 v3(84.41,16.62)
J_SRST: length 8.7
  Top Layer w0.254: 90.4,14.72 89.65,14.72 86.47,17.89 v3(84.41,17.89)
  Bottom Layer w0.254: 83.06,17.89 v3(84.41,17.89)
J_TCK: length 7.6
  Top Layer w0.254: 90.4,22.34 88.33,22.34 87.69,21.7 v3(84.41,21.7)
  Bottom Layer w0.254: P2.10 v3(84.41,21.7)
J_TDI: length 8.7
  Top Layer w0.254: 90.4,27.42 89.65,27.42 86.47,24.24 v3(84.41,24.24)
  Bottom Layer w0.254: P2.6 v3(84.41,24.24)
J_TDO: length 8.1
  Top Layer w0.254: v3(84.41,19.16) 87.75,19.16 89.65,17.26 90.4,17.26
  Bottom Layer w0.254: P2.14 v3(84.41,19.16)
J_TMS: length 8.1
  Top Layer w0.254: 90.4,24.88 89.65,24.88 87.75,22.97 v3(84.41,22.97)
  Bottom Layer w0.254: 83.06,22.97 v3(84.41,22.97)
J_TRST: length 9.2
  Top Layer w0.254: 90.4,29.96 89.64,29.96 85.2,25.51 v3(84.41,25.51)
  Bottom Layer w0.254: P2.4 v3(84.41,25.51)
J_USB_DM: length 12.9
  Bottom Layer w0.254: U10.7 41.02,28.35 41.26,28.11 48.62,28.11 51.22,25.51 51.96,25.51
J_USB_DP: length 13.6
  Bottom Layer w0.254: U10.8 48.52,27.71 50.63,25.6 50.63,24.83 51.22,24.24 51.96,24.24
J_VOUT: length 34.3
  Top Layer w0.508: v2(29.74,22.58) 31.93,22.58 v2(33.35,24) ; v2(24.75,22.58) 15.19,22.58 11.94,19.33 v2(11.94,17.42)
  Bottom Layer w0.482: R1.2 35.45,25.89 U1.5
  Bottom Layer w0.508: R1.2 34.79,25.44 v2(33.35,24) ; v2(11.94,17.42) 11.94,14.15 10.5,12.71 v1(10.5,12.6) ; v2(29.74,22.58) v2(24.75,22.58)
  vias: v1(8.1,12.6) v1(9.3,12.6)
J_VREF: length 54.9
  Top Layer w0.482: v2(48.73,26.78) v2(50.68,26.78)
  Top Layer w0.508: v2(84.41,26.78) 86.82,29.19 86.82,29.67 89.65,32.5 90.4,32.5 ; v2(55.65,26.78) v2(53.57,26.78)
  Bottom Layer w0.482: v2(50.68,26.78) v2(53.57,26.78) ; U1.1 41.44,25.89 42.33,26.78 v2(48.73,26.78)
  Bottom Layer w0.508: v2(84.41,26.78) P2.2 v2(55.65,26.78)
O_3.3V: length 131.5
  Top Layer w0.152: v3(73.9,51.79) 71.6,49.49 v3(71.6,47.73) 71.98,47.73 72.26,47.45 72.26,47.02 72.54,46.74 73.8,46.74 v3(74.21,46.32)
  Top Layer w0.381: 74.15,40.59 v3(74.15,39.25) ; 74.15,40.59 77.32,40.59 78.82,42.09 v3(78.82,43.01) ; 74.15,40.59 71.45,40.59 v3(71.36,40.5) ; v3(64.86,46.29) v3(64.86,45.16) ; U16.25 U16.26 ; v3(77.23,44.57) 78.59,44.57 v3(78.82,44.35)
  Bottom Layer w0.152: D1.4 66.64,57.3 66.77,57.16 66.77,56.59 66.64,56.45 D1.3 64.27,56.45 63.77,55.94
  Bottom Layer w0.178: 81.37,44.16 81.37,42.78 C24.2 81.37,41.78 81.37,40.11 C28.2 ; 81.37,44.16 80.5,44.16 79.35,43.01 v3(78.82,43.01) ; 81.37,44.16 81.37,44.45 C23.2 81.37,45.45 81.37,47.13 C27.2 81.37,48.13 81.37,49.8 C26.2 81.37,50.8 81.37,52.47 C25.2
  Bottom Layer w0.201: U2.34 70.4,42.88 70.51,43 71.2,43 ; U2.6 v3(71.6,47.73) ; 71.2,43 U2.32 ; 71.2,43 71.6,43 ; v3(73.9,51.79) R3.2 ; 71.6,41.69 U2.31 71.6,43 ; 75.46,46.32 U2.16 v3(74.21,46.32) ; U2.29 72.4,42.88 72.28,43 71.6,43
  Bottom Layer w0.254: U9.1 C28.2 ; U4.1 C23.2 ; U6.1 C25.2 ; U7.1 C26.2 ; U8.1 C27.2 ; U5.1 C24.2
  Bottom Layer w0.28: 75.46,46.32 76.54,46.32 C13.2
  Bottom Layer w0.381: v3(64.86,45.16) 64.86,43.83 63.4,42.37 63.4,39.24 64.36,38.28 73.74,38.28 74.15,38.69 v3(74.15,39.25) ; v3(77.23,44.57) 76.75,45.05 C8.2 76.7,45.13 C13.2 ; 71.6,41.63 71.6,41.38 71.81,41.17 C18.2 71.7,40.5 v3(71.36,40.5) 71.02,40.5 C12.2 ; v3(78.82,43.01) v3(78.82,44.35) ; U16.25 30.38,54.41 33.63,54.41 35.41,56.18 63.53,56.18 63.77,55.94 64.03,55.68 64.03,48.45 P3.1 v3(64.86,46.29)
O_5V: length 46.5
  Top Layer w0.254: v3(63.53,56.75) 66.01,56.75 67.21,55.55 v3(67.21,55.27) ; U16.27 U16.28
  Bottom Layer w0.254: U19.8 C6.1 70.74,55.59 69.79,55.59 69.67,55.46 68.34,55.46 68.15,55.27 v3(67.21,55.27) ; U16.27 31.23,54.83 33.26,54.83 35.15,56.72 63.5,56.72 v3(63.53,56.75)
O_ADC_VREF: length 4
  Bottom Layer w0.201: U2.27 73.2,41.66 73.58,41.27 C7.2 73.58,40.35 74.07,39.86 74.47,39.86 74.96,39.38 R52.2
O_JTAG_TCK: length 6.3
  Bottom Layer w0.152: U2.47 68.27,47.12 65.66,49.72 65.66,50.64 P3.4
O_JTAG_TDI: length 8.4
  Bottom Layer w0.152: 64.86,53.97 65.54,53.3 65.54,51.99 65.91,51.61 65.91,49.83 68.22,47.52 U2.48
O_JTAG_TDO: length 10
  Bottom Layer w0.152: P3.7 65.79,54.31 65.79,52.09 66.17,51.72 66.17,49.93 67.78,48.32 U2.1
O_JTAG_TMS: length 5.4
  Bottom Layer w0.152: U2.46 68.31,46.72 P3.3
O_LED_GREEN: length 74.8
  Top Layer w0.152: v3(62.63,54.66) 64.15,56.18 65.41,56.18 v3(66.16,55.42)
  Top Layer w0.254: U15.25 U15.26
  Bottom Layer w0.152: R8.1 69.81,56.45 69.38,56.02 68.11,56.02 68,55.91 66.65,55.91 v3(66.16,55.42) 66.16,54.96 66.04,54.84 66.04,52.2 66.35,51.9 arc(66.4,51.82) 66.42,51.72 66.42,50.47 67.94,48.95 69.75,48.95 70,48.7 U2.2
  Bottom Layer w0.254: U15.26 55.12,6.23 55.12,47.15 62.63,54.65 v3(62.63,54.66)
O_LED_RED: length 77.5
  Top Layer w0.152: v3(61.96,54.61) 63.78,56.43 65.72,56.43 v3(66.71,55.43)
  Top Layer w0.254: U15.23 U15.24
  Bottom Layer w0.152: U2.3 70.4,48.68 69.88,49.2 68.55,49.2 66.75,51 66.75,51.96 66.34,52.37 66.34,54.61 66.71,54.98 v3(66.71,55.43) 66.93,55.65 68.1,55.65 68.22,55.77 69.49,55.77 69.64,55.92 70.24,55.92 70.44,56.13 70.44,56.86 70,57.3 R7.1
  Bottom Layer w0.254: U15.24 54.77,7.15 54.77,47.42 v3(61.96,54.61)
O_MCU_PWR: length 21.7
  Top Layer w0.152: v3(85.47,54.85) 85.8,54.52 85.8,53.09 84.86,52.15 82.89,52.15 81.24,50.5 74.63,50.5 73.97,49.83 73.97,49.32 v3(74.26,49.03)
  Bottom Layer w0.152: U2.12 74,48.77 v3(74.26,49.03) ; R15.2 82.38,55.72 U3.4 83.58,55.72 84.44,54.85 v3(85.47,54.85)
O_MCU_SRST_IN: length 9.4
  Top Layer w0.152: v3(78.18,42.24) 76.37,42.24 74.21,44.39 v3(74.21,45.12)
  Bottom Layer w0.152: v3(78.18,42.24) 79.48,42.24 80.81,40.91 R22.1
  Bottom Layer w0.201: U2.19 v3(74.21,45.12)
O_MCU_SRST_OUT: length 10.3
  Top Layer w0.152: v3(68.08,42.89) 68.43,42.89 70.22,41.1 v3(74.19,41.1)
  Bottom Layer w0.152: v3(74.19,41.1) 74.96,40.34 R23.1 74.96,40.23 75.43,39.76 Q1.1
  Bottom Layer w0.201: U2.37 68.31,43.12 68.09,42.89
O_MCU_TCK: length 13.8
  Top Layer w0.152: v3(74.21,43.12) 74.06,42.97 72.62,42.97 72.24,43.35 72.24,43.57 71.91,43.89 71.7,43.89 71.32,44.26 71.32,44.48 71.03,44.78 69.44,44.78 v3(69.38,44.72)
  Bottom Layer w0.152: U2.24 75.8,43.12 76.31,42.62 79.85,42.62 80.82,43.58 R18.1
  Bottom Layer w0.201: U2.24 v3(74.21,43.12) ; U2.41 v3(69.38,44.72)
O_MCU_TDI: length 17.6
  Top Layer w0.152: v3(79.32,44.27) 79.02,43.97 78.49,43.97 78.28,44.17 77.09,44.17 76.55,44.72 v3(75.51,44.72)
  Bottom Layer w0.152: U2.22 74.23,43.92 74.12,44.03 74.12,44.6 74.23,44.72 U2.20 ; R19.1 80.87,54.27 79.88,53.29 79.88,44.84 v3(79.32,44.27)
  Bottom Layer w0.201: U2.20 v3(75.51,44.72)
O_MCU_TDO: length 14.7
  Top Layer w0.152: v3(79.7,43.95) 79.7,43.94 79.48,43.72 78.38,43.72 78.18,43.92 v3(75.92,43.92)
  Bottom Layer w0.152: U2.23 75.52,43.52 v3(75.92,43.92) 75.52,44.32 U2.21 ; v3(79.7,43.95) 80.26,44.51 80.26,50.99 R20.1
O_MCU_TMS: length 17.1
  Top Layer w0.102: v3(80.87,46.84) 80.87,46.51 80.75,46.38 74.78,46.38 74.36,45.97 73.92,45.97 73.86,45.9 69.22,45.9 v3(68,44.67)
  Bottom Layer w0.152: v3(68,44.67) 68.35,44.32 U2.40 69.36,44.32 69.48,44.2 69.48,44.03 69.36,43.92 U2.39 ; v3(80.87,46.84) R17.1
O_MCU_TRST: length 10.4
  Top Layer w0.152: v3(80.87,49.51) 79.66,49.51 79.53,49.38 75.82,49.38 v3(74.5,48.06)
  Bottom Layer w0.152: U2.8 72.4,47.77 72.49,47.68 74.12,47.68 v3(74.5,48.06) ; v3(80.87,49.51) R21.1
O_RST: length 14.2
  Top Layer w0.152: P3.5 66.55,52.7 66.72,52.53 v3(66.72,52.53) ; v3(68.2,50.7) v3(69.75,50.7)
  Bottom Layer w0.152: v3(66.72,52.53) 68.2,51.05 v3(68.2,50.7) ; v3(69.75,50.7) 73.4,50.7 R3.1 C1.2 75.01,49.99 75.01,47.52 U2.13
O_SPI_CS: length 12.3
  Top Layer w0.152: v3(75.17,42.4) 74.88,42.11 69.61,42.11 68.44,43.28 v3(67.69,43.28)
  Bottom Layer w0.201: U2.25 74,42.4 v3(75.17,42.4) ; U2.42 67.88,45.12 67.59,44.83 67.59,43.38 v3(67.69,43.28)
O_SRST: length 15.2
  Bottom Layer w0.152: R25.2 80.29,38.89 87.68,38.89 88.19,39.4 88.19,40.27 R24.2 ; R24.2 87.55,40.91 R31.2 ; R24.2 87.75,40.76 89.63,42.64 90.4,42.64
O_SRST_DIR: length 14.3
  Bottom Layer w0.152: U2.26 73.6,41.74 73.77,41.57 74.31,41.57 74.55,41.81 75.11,41.81 75.62,42.32 77.22,42.32 77.96,41.57 78.78,41.57 80.21,40.13 80.21,39.42 80.49,39.14 83.51,39.14 84.63,40.26 U9.5
O_TCK: length 4
  Top Layer w0.152: v3(88.5,43.43) 88.87,43.43 89.67,42.64 90.4,42.64
  Bottom Layer w0.152: R27.2 87.55,43.58 R33.2 v3(88.5,43.43)
O_TCK_DIR: length 11
  Top Layer w0.152: v3(81.78,44.24) 80.77,44.24 79.49,45.52 v3(75.51,45.52)
  Bottom Layer w0.152: 84.73,42.89 84.69,42.89 83.34,44.24 v3(81.78,44.24)
  Bottom Layer w0.201: U2.18 v3(75.51,45.52)
O_TDI: length 6.4
  Bottom Layer w0.152: R28.2 87.55,54.27 R34.2 88.65,53.18 88.65,51.26 89.64,50.26 90.4,50.26
O_TDI_DIR: length 15.8
  Top Layer w0.152: v3(84.12,54.15) 78.54,54.15 75.72,51.33 74.3,51.33 v3(72,49.03)
  Bottom Layer w0.152: U6.5 84.65,53.62 v3(84.12,54.15)
  Bottom Layer w0.201: U2.7 v3(72,49.03)
O_TDO: length 6.3
  Bottom Layer w0.152: 90.4,47.72 89.64,47.72 88.54,48.82 88.54,50.61 R35.2 87.55,51.6 R29.2
O_TMS: length 4.1
  Top Layer w0.152: 90.4,45.18 v3(88.58,45.18)
  Bottom Layer w0.152: v3(88.58,45.18) 87.7,46.05 R32.2 87.55,46.25 R26.2
O_TMS_DIR: length 19.8
  Top Layer w0.102: v3(67.99,44.12) 68.38,44.5 68.38,44.74 69.33,45.7 73.94,45.7 74.01,45.76 74.44,45.76 74.86,46.18 81.17,46.18 v3(81.8,46.81)
  Bottom Layer w0.152: v3(67.99,44.12) 67.99,43.77 68.24,43.52 U2.38 ; U4.5 84.66,45.6 83.45,46.81 v3(81.8,46.81)
O_TRST: length 6.2
  Bottom Layer w0.152: R30.2 87.55,48.93 R36.2 88.54,47.94 88.54,46.3 89.67,45.18 90.4,45.18
O_TRST_DIR: length 13.1
  Top Layer w0.152: v3(74.35,49.67) 74.91,50.24 81.04,50.24 v3(81.8,49.48)
  Bottom Layer w0.152: U2.11 73.6,48.93 v3(74.35,49.67) ; U8.5 84.66,48.28 83.45,49.48 v3(81.8,49.48)
O_USB_DM: length 35.9
  Top Layer w0.201: v3(52.77,41.86) 53.81,42.9 v3(55.61,42.9)
  Bottom Layer w0.201: U2.43 68.27,45.52 68.22,45.56 58.27,45.56 v3(55.61,42.9) ; v3(52.77,41.86) 52.77,40.71 41.68,29.63 U10.5
O_USB_DP: length 36.9
  Top Layer w0.201: v3(53.17,42.9) 53.69,43.41 v3(55.55,43.41)
  Bottom Layer w0.201: U2.44 68.27,45.92 68.22,45.87 58.01,45.87 v3(55.55,43.41) ; v3(53.17,42.9) 53.17,41.66 53.07,41.56 53.07,40.59 41.8,29.32 41.31,29.32 40.98,28.99 U10.6
O_VDD_SOC: length 44.8
  Top Layer w0.381: v3(66.9,45.15) v3(66.9,46.91) 66.9,47.85 v3(68.96,49.91) ; v3(72.36,40.03) 72.35,40.01 70.36,40.01 v3(70.33,40.03) 69.98,40.39 69.98,40.8 v3(68.91,41.87)
  Bottom Layer w0.201: 72.8,41.66 U2.28 ; U2.5 71.2,49.1 ; 70.8,41.66 U2.33 ; U2.9 72.8,49.1 ; U2.45 68.11,46.32
  Bottom Layer w0.381: 69.25,50.2 v3(68.96,49.91) ; 69.25,50.2 C17.2 ; 69.25,50.2 69.25,51.55 69.98,52.28 75.18,52.28 75.59,51.87 78.05,51.87 78.8,51.12 C16.2 ; C17.2 70.26,49.53 70.6,49.18 71,49.18 71.11,49.07 ; C17.2 C21.2 71.16,50.1 71.68,49.58 72.2,49.58 72.71,49.07 ; 70.8,41.66 70.8,41.25 70.03,40.48 C11.2 70.03,40.34 v3(70.33,40.03) ; 68.11,46.32 66.9,46.32 ; v3(66.9,46.91) C22.2 ; v3(72.36,40.03) 72.69,40.36 C20.2 72.8,40.51 72.8,41.66 ; v3(68.91,41.87) 68.54,42.24 68.03,42.24 66.9,43.36 v3(66.9,45.15)
  Bottom Layer w0.635: C16.2 C19.2 78.8,48.13 L1.2
O_VIO: length 43.2
  Top Layer w0.152: v3(71.69,53.42) v3(74.1,53.42)
  Top Layer w0.254: v3(80.01,55.35) 80.29,55.07 v3(80.77,55.07)
  Bottom Layer w0.152: R24.1 86.98,40.48 86.26,40.48 ; R11.1 77.41,57.48 75.56,57.48 74.96,56.87 74.96,54.28 v3(74.1,53.42) ; R9.1 71.57,53.42 v3(71.69,53.42)
  Bottom Layer w0.178: C31.2 86.26,52.47 86.26,50.8 C32.2 86.26,49.8 86.26,48.13 C33.2 86.26,47.13 86.26,45.45 C29.2 86.26,44.45 86.26,42.78 C30.2 86.26,41.78 86.26,40.11 C34.2
  Bottom Layer w0.254: U7.6 C32.2 ; U9.6 C34.2 ; U4.6 C29.2 ; v3(80.77,55.07) 83.11,55.07 83.63,54.55 83.63,53.53 84.19,52.97 U6.6 C31.2 ; U5.6 C30.2 ; U8.6 C33.2 ; R11.1 C3.2 R12.1 79.35,57.33 80.01,56.66 v3(80.01,55.35)
O_VOUT: length 54.1
  Top Layer w0.381: U16.29 U16.30 ; v2(65.22,57.61) v2(80.26,57.61)
  Bottom Layer w0.381: U3.5 82.65,57.61 v2(80.26,57.61) ; v2(65.22,57.61) 64.85,57.24 34.89,57.24 32.89,55.24 32.08,55.24 U16.29
O_VREF: length 18.5
  Top Layer w0.152: v3(83.2,57.05) 83.32,57.18 v3(84.18,57.18)
  Top Layer w0.482: 90.4,50.26 v2(90.4,51.39)
  Bottom Layer w0.152: U3.1 84.62,57.62 v3(84.18,57.18) ; R13.1 80.39,55.17 80.39,56.53 81.05,57.2 81.99,57.2 82.13,57.05 v3(83.2,57.05)
  Bottom Layer w0.482: v2(90.4,51.39) 90.4,52.46 87,55.87 87,57.13 86.51,57.62 U3.1
O_VREF_PWM: length 74.4
  Top Layer w0.152: v3(63.22,54.69) 64.45,55.92 65.18,55.92 65.68,55.42 65.68,54.98 v3(67.12,53.55) ; v3(70.8,47.73) 70.8,48.54 v3(69.76,49.58)
  Top Layer w0.254: U15.22 U15.21
  Bottom Layer w0.152: v3(69.76,49.58) 69.36,49.58 69.24,49.45 68.86,49.45 68.58,49.73 68.58,52.17 67.67,53.08 R5.1 R4.1
  Bottom Layer w0.201: U2.4 v3(70.8,47.73)
  Bottom Layer w0.254: U15.22 54.08,7.73 54.08,47.78 61.43,55.13 62.78,55.13 v3(63.22,54.69) ; R4.1 66.77,53.2 v3(67.12,53.55)
O_XIN: length 6.8
  Bottom Layer w0.198: X1.1 64.84,40.41 65.34,40.9 66.38,40.9 66.88,40.4 C4.2
  Bottom Layer w0.201: C4.2 67.24,40.74 68.86,40.74 70,41.88 U2.35
O_XOUT: length 4.7
  Bottom Layer w0.201: X1.3 66.06,41.4 C5.2 67.25,41.04 68.73,41.04 69.6,41.91 U2.36
R_USB_DM: length 36.3
  Bottom Layer w0.254: U10.1 41.2,32.19 41.45,32.44 41.45,33.9 38.96,36.4 37.73,36.4 18.73,55.4 17.96,55.4 U16.7
R_USB_DP: length 36.1
  Bottom Layer w0.254: U16.9 37.87,36.75 39.11,36.75 41.81,34.05 41.81,32.28 41.08,31.55 U10.2
RS485_A1: length 15.3
  Top Layer w0.254: U18.1 3.35,47.03 3.35,52.43 4.98,54.06 4.98,56.67 P4.8
RS485_A2: length 16.6
  Top Layer w0.254: P4.7 5.71,54.28 3.91,52.48 3.91,45.05 U18.2
RS485_B1: length 14.9
  Top Layer w0.254: v3(4.95,45.29) 4.95,52.52 7.71,55.27 7.71,56.67 6.98,57.4
  Bottom Layer w0.254: v3(4.95,45.29) 4.19,44.53 R50.1
RS485_B2: length 15.6
  Top Layer w0.254: 6.98,56.13 6.32,55.47 6.32,54.39 4.39,52.46 v3(4.39,42.9)
  Bottom Layer w0.254: R51.1 4.39,41.9 v3(4.39,42.9)
SOC_USB_DM: length 34.2
  Top Layer w0.254: v3(28.53,33.43) 29.59,32.37 29.59,30.61 29.93,30.26 30.19,30.26 v3(30.27,30.34)
  Bottom Layer w0.254: U14.3 v3(30.27,30.34) ; U16.3 28.38,42.44 28.38,33.58 v3(28.53,33.43)
SOC_USB_DP: length 36.2
  Top Layer w0.254: v3(30.27,29.82) 30.19,29.9 29.8,29.9 29.24,30.46 29.24,32.12 v3(28.02,33.33)
  Bottom Layer w0.254: v3(30.27,29.82) 30.77,29.32 30.77,27.8 ; v3(28.02,33.33) 28.02,42.29 14.92,55.4 14.15,55.4 U16.1
U_1.8V: length 31.6
  Top Layer w0.254: v3(12.96,36.95) 12.64,37.26 12.64,39.35 v3(12.17,39.81)
  Top Layer w0.381: v3(11.27,35.08) 11.27,34.19 v3(8.8,31.72) 10.61,29.92 v3(10.61,28.34)
  Bottom Layer w0.254: v3(12.96,36.95) 14.48,36.95 R39.2 C39.2
  Bottom Layer w0.355: U12.25 12.46,32.22 C48.1 ; C48.1 12.16,31.72 12.31,31.57 U12.24 ; C48.1 C46.1 C43.1 v3(8.8,31.72) ; U12.18 C49.1 C47.1 C44.1
  Bottom Layer w0.381: C44.1 10.17,28.14 10.37,28.34 v3(10.61,28.34) ; v3(12.17,39.81) 11.99,39.81 11.27,39.09 v3(11.27,35.08)
U_3.3V: length 13.3
  Top Layer w0.152: v3(15.94,29.22) v3(15.94,30.66)
  Bottom Layer w0.152: U12.16 v3(15.2,26.37) 15.94,27.11 v3(15.94,29.22) ; v3(15.94,30.66) 15.94,32.79 v3(15.2,33.52) U12.27
  Bottom Layer w0.355: U12.27 11.27,33.52 C42.2
U_5V: length 18
  Top Layer w0.381: v2(18.38,39.76) 16.72,39.76 v3(14.82,37.86) 13.38,36.42 12.61,36.42 12.38,36.66 v2(10.5,36.66)
  Bottom Layer w0.254: v3(14.82,37.86) 13.98,37.86
  Bottom Layer w0.355: B1.2 10.19,35.56 C41.2 10.57,34.35 11.48,34.35 11.66,34.17 U12.28
  Bottom Layer w0.381: B1.2 v2(10.5,36.66)
  Bottom Layer w0.482: 16.58,39.76 v2(18.38,39.76)
U_GND: length 64.7
  Top Layer w0.355: v3(12.39,29.72) 12.39,28.47 v3(12.53,28.32)
  Top Layer w0.381: v3(15.2,32.87) 15.41,32.67 v3(15.41,28.97)
  Top Layer w0.508: U13.1 15.82,16.03 16.26,16.46 19.2,16.46 v2(19.74,15.93) ; USB1.1 8.43,33.11 ; USB1.12 v2(7.96,26.79) ; v2(12.16,37.29) 9.97,37.29 8.43,35.75 v3(8.43,33.11)
  Bottom Layer w0.152: 8.43,33.78 9.31,34.65
  Bottom Layer w0.355: C46.2 10.19,32.74 C41.1 ; C46.2 C43.2 8.82,32.72 v3(8.43,33.11) C37.1 ; C46.2 C42.1 C48.2 12.11,32.87 U12.26 ; v3(12.53,28.32) U12.19 15.41,28.32 ; 15.41,28.32 15.41,27.3 15.14,27.02 U12.17 12.3,27.02 C49.2 C47.2 C44.2 R37.1 9.18,26.79 v2(7.96,26.79) ; 15.41,28.32 v3(15.41,28.97) U12.20 ; 13.86,32.87 v3(15.2,32.87)
  Bottom Layer w0.381: v3(12.39,29.72) D3.2
  Bottom Layer w0.508: v2(19.74,15.93) 21.01,14.66 R43.1 ; U13.1 15.82,16.66 C45.1 15.74,20.88 11.66,24.97 8.81,24.97 7.96,25.82 v2(7.96,26.79)
  vias: v3(15.57,15.24) v3(15.57,14.5) v3(15.57,13.77) v3(16.08,15.24) v3(16.08,14.5) v3(16.08,13.77)
U_USB_DM: length 12.7
  Top Layer w0.254: 7.33,29.7 v3(7.94,29.7) ; 7.33,30.7 v3(7.94,30.7)
  Bottom Layer w0.254: v3(7.94,29.7) v3(7.94,30.7) 9.2,30.7 D3.6 9.52,30.67 9.97,30.22 10.78,30.22 11.24,30.67 D3.1 11.84,30.67 12.24,30.27 U12.22 14.98,30.27 15.11,30.15 16.76,30.15 17.31,30.7 R44.1
U_USB_DP: length 13.3
  Top Layer w0.254: USB1.8 v3(8.37,29.2) 8.37,29.88 8.05,30.2 USB1.6
  Bottom Layer w0.254: R45.1 17.31,29.2 16.76,29.75 15.11,29.75 14.98,29.62 12.98,29.62 12.59,29.24 12.23,29.24 11.77,28.77 D3.3 11.24,28.77 10.78,29.23 9.97,29.23 9.52,28.77 D3.4 8.8,28.77 v3(8.37,29.2)
U_VBUS: length 36
  Top Layer w0.381: v3(10.09,29.72) 10.09,27.55
  Top Layer w0.508: 10.09,27.55 v2(11.88,25.77) ; USB1.2 v2(7.96,32.31) ; 10.05,27.59 v2(7.96,27.59) USB1.11
  Bottom Layer w0.381: B1.1 8.43,35.29 C37.2 7.78,34.08 7.78,33.02 7.96,32.84 v2(7.96,32.31) ; v3(10.09,29.72) D3.5
  Bottom Layer w0.508: v2(7.96,27.59) 7.33,28.22 7.33,31.68 v2(7.96,32.31) ; v2(11.88,25.77) 16.46,21.18 16.46,19 18.44,17.01 C45.2 ; C45.2 R42.1 ; C45.2 18.36,16.66 U13.2
  vias: v3(18.11,15.24) v3(18.11,14.5) v3(18.11,13.77) v3(18.62,15.24) v3(18.62,14.5) v3(18.62,13.77)
USB_SWITCH: length 30.1
  Bottom Layer w0.152: U14.1 29.27,33.92 29.71,34.37 R41.1 29.77,42.32 U16.5
$2N68176: length 3.1
  Bottom Layer w0.254: 16.61,37.86 16.61,36.8 R40.2 R39.1 C39.1
$2N73583: length 1.3
  Bottom Layer w0.254: R49.2 U17.3
$2N73588: length 1.3
  Bottom Layer w0.254: R48.2 U17.4
$2N82814: length 2.2
  Top Layer w0.152: 7.33,28.2 v3(8.83,28.2)
  Bottom Layer w0.152: v3(8.83,28.2) 9.29,27.74 R37.2
$2N82862: length 3.7
  Top Layer w0.152: v3(9.01,33.32) 9.01,32.88 8.57,32.44 8.57,32.14 8.17,31.74 8.17,31.37 8,31.2 7.33,31.2
  Bottom Layer w0.152: R38.2 9.31,33.63 v3(9.01,33.32)
$2N86419: length 1.3
  Bottom Layer w0.254: U18.3 R51.2
$2N86421: length 1.3
  Bottom Layer w0.254: U18.4 R50.2
$3N2712: length 2.9
  Bottom Layer w0.201: 73.2,48.99 U2.10
  Bottom Layer w0.381: C10.2 C15.2 73.2,49.98 73.2,48.99
$3N8964: length 1
  Bottom Layer w0.152: 84.77,46.25 R26.1
$3N8968: length 1
  Bottom Layer w0.152: 82.87,46.25 R17.2
$3N9272: length 1
  Bottom Layer w0.152: U5.4 R27.1
$3N9276: length 1
  Bottom Layer w0.152: U5.3 R18.2
$3N9580: length 1
  Bottom Layer w0.152: U6.3 R19.2
$3N9584: length 1
  Bottom Layer w0.152: U6.4 R28.1
$3N9863: length 1
  Bottom Layer w0.152: U7.4 R29.1
$3N10368: length 1
  Bottom Layer w0.152: U8.3 R21.2
$3N10370: length 1
  Bottom Layer w0.152: U8.4 R30.1
$3N15287: length 1.5
  Bottom Layer w0.152: R25.1 78.57,40.71 Q1.3
$3N15535: length 1
  Bottom Layer w0.152: U7.3 R20.2
$3N15658: length 1.3
  Bottom Layer w0.254: U3.3 R16.2
$3N17768: length 1.5
  Bottom Layer w0.152: D1.2 R8.2
$3N17773: length 1.5
  Bottom Layer w0.152: D1.1 R7.2
$3N17799: length 4
  Bottom Layer w0.196: U2.17 75.91,45.92
  Bottom Layer w0.381: 76.7,43.27 76.7,43.84 76.01,44.53 76.01,45.74 75.92,45.83
$3N32383: length 1
  Bottom Layer w0.152: U9.3 R22.2
$3N32384: length 1
  Bottom Layer w0.152: U9.4 R31.1
$3N34404: length 6
  Bottom Layer w0.152: U19.5 72.1,53.15 71.6,52.65 69.94,52.65 C2.2 R6.1 68.57,53.23 R5.2
$3N34406: length 2.5
  Bottom Layer w0.152: U19.6 71.6,53.8 R9.2 R10.1
$3N34408: length 1.6
  Bottom Layer w0.254: R11.2 76.65,56.37 D2.1
$3N34409: length 3.3
  Bottom Layer w0.254: U19.7 73.43,54.45 73.84,54.87 73.84,56.83 D2.2
$3N37219: length 3
  Bottom Layer w0.152: U19.3 78.16,53.8 R14.1 79.35,53.27 R13.2
$3N61637: length 35.4
  Top Layer w0.201: v3(83.49,46.22) v3(83.49,47.18) ; v3(83.49,48.86) v3(83.49,49.86) ; v3(83.49,39.65) 82.8,38.96 v3(79.45,38.96) ; v3(83.49,43.51) v3(83.49,44.59) ; v3(81.79,52.32) v3(79.51,52.32)
  Bottom Layer w0.201: v3(79.51,52.32) 75.87,52.32 75.26,52.93 75.26,53.72 75.99,54.45 U19.2 77.94,54.45 78.09,54.6 78.09,54.95 77.94,55.1 U19.1 ; v3(83.49,49.86) 83.49,51.79 82.96,52.32 v3(81.79,52.32) ; v3(83.49,44.59) v3(83.49,46.22) ; v3(79.45,38.96) 75.54,38.96 74.96,38.37 R52.1 ; v3(83.49,47.18) v3(83.49,48.86) ; v3(83.49,39.65) v3(83.49,43.51)
$4N2763: length 1.2
  Bottom Layer w0.254: U1.3 39.73,23.99 R2.2
$4N2764: length 1.4
  Bottom Layer w0.254: U1.4 35.4,23.99 35,24.39 R1.1
$5N259: length 4.4
  Bottom Layer w0.254: X2.3 38.42,33.22 36.74,31.55 U10.15
$5N263: length 5.4
  Bottom Layer w0.254: U10.16 36.88,32.19 37.48,32.79 37.48,33.95 X2.1

## Copper pours and planes (outline as drawn; the poured copper is in the pictures)
GND on Top Layer: 36.93,2.51 36.04,3.4 36.04,13.36 35.92,13.49 30.58,13.49 30.53,13.54 30.53,17.48 22.5,25.5 22.5,45.97 12.93,55.55 12.93,57.18 13.15,57.4 84.94,57.4 85.45,56.9 85.45,55.07 87.83,52.68 90.22,52.68 91.9,51 91.9,7.85 91.34,7.29 87.99,7.29 85.52,4.83 85.52,2.97 85.07,2.52 56.49,2.52 56.49,2.51
U_1.8V on Bottom Layer: 13.07,39.42 11.65,39.42 11.6,39.47 11.6,42.88 11.67,42.95 12.64,42.95 12.69,42.9 12.69,40.72 13.07,40.34
U_GND on Bottom Layer: 11.85,38.98 11.86,39.04 11.9,39.09 11.94,39.12 12,39.13 17.97,39.13 18.03,39.12 18.08,39.09 18.11,39.04 18.12,38.98 18.12,35.3 18.11,35.25 18.08,35.2 18.03,35.16 17.97,35.15 12,35.15 11.94,35.16 11.9,35.2 11.86,35.25 11.85,35.3
$2N68073 on Bottom Layer: 13.38,39.45 14.54,39.45 14.9,39.8 14.9,42.88 14.82,42.95 13.86,42.95 13.81,42.9 13.81,40.72 13.38,40.28
$3N3280 on Bottom Layer: 74.52,46.62 77.44,46.62 77.61,46.78 77.61,48.98 77.58,49 76.38,49 75.57,48.2 75.57,47.2 75.19,46.82 74.52,46.82

Small or netless copper shapes (teardrops, artwork), in the pictures only: 193 on Top Layer, 855 on Bottom Layer

## Text on the board
Bottom Silkscreen Layer: TDO | TDI | TCK | TMS | GND | SRST | 3.3V
Top Silkscreen Layer: JLCJLCJLCJLC | 24/11/02 Peace | Embedded Tools B2 V1.1
